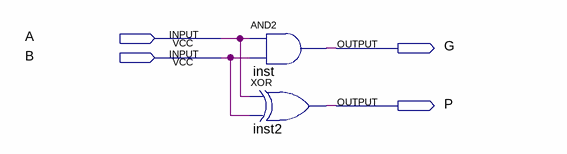
[diagram p0: schematic sheet]
// Quartus schematic carry_lookahead.bdf as structural Verilog: 2 symbols, 4 pins
module carry_lookahead (
  input  A,
  input  B,
  output G,
  output P
);

  and inst (G, A, B);
  xor inst2 (P, A, B);
endmodule
